# EAGLE schematic circuito_tesi (EAGLE 9.6.2)
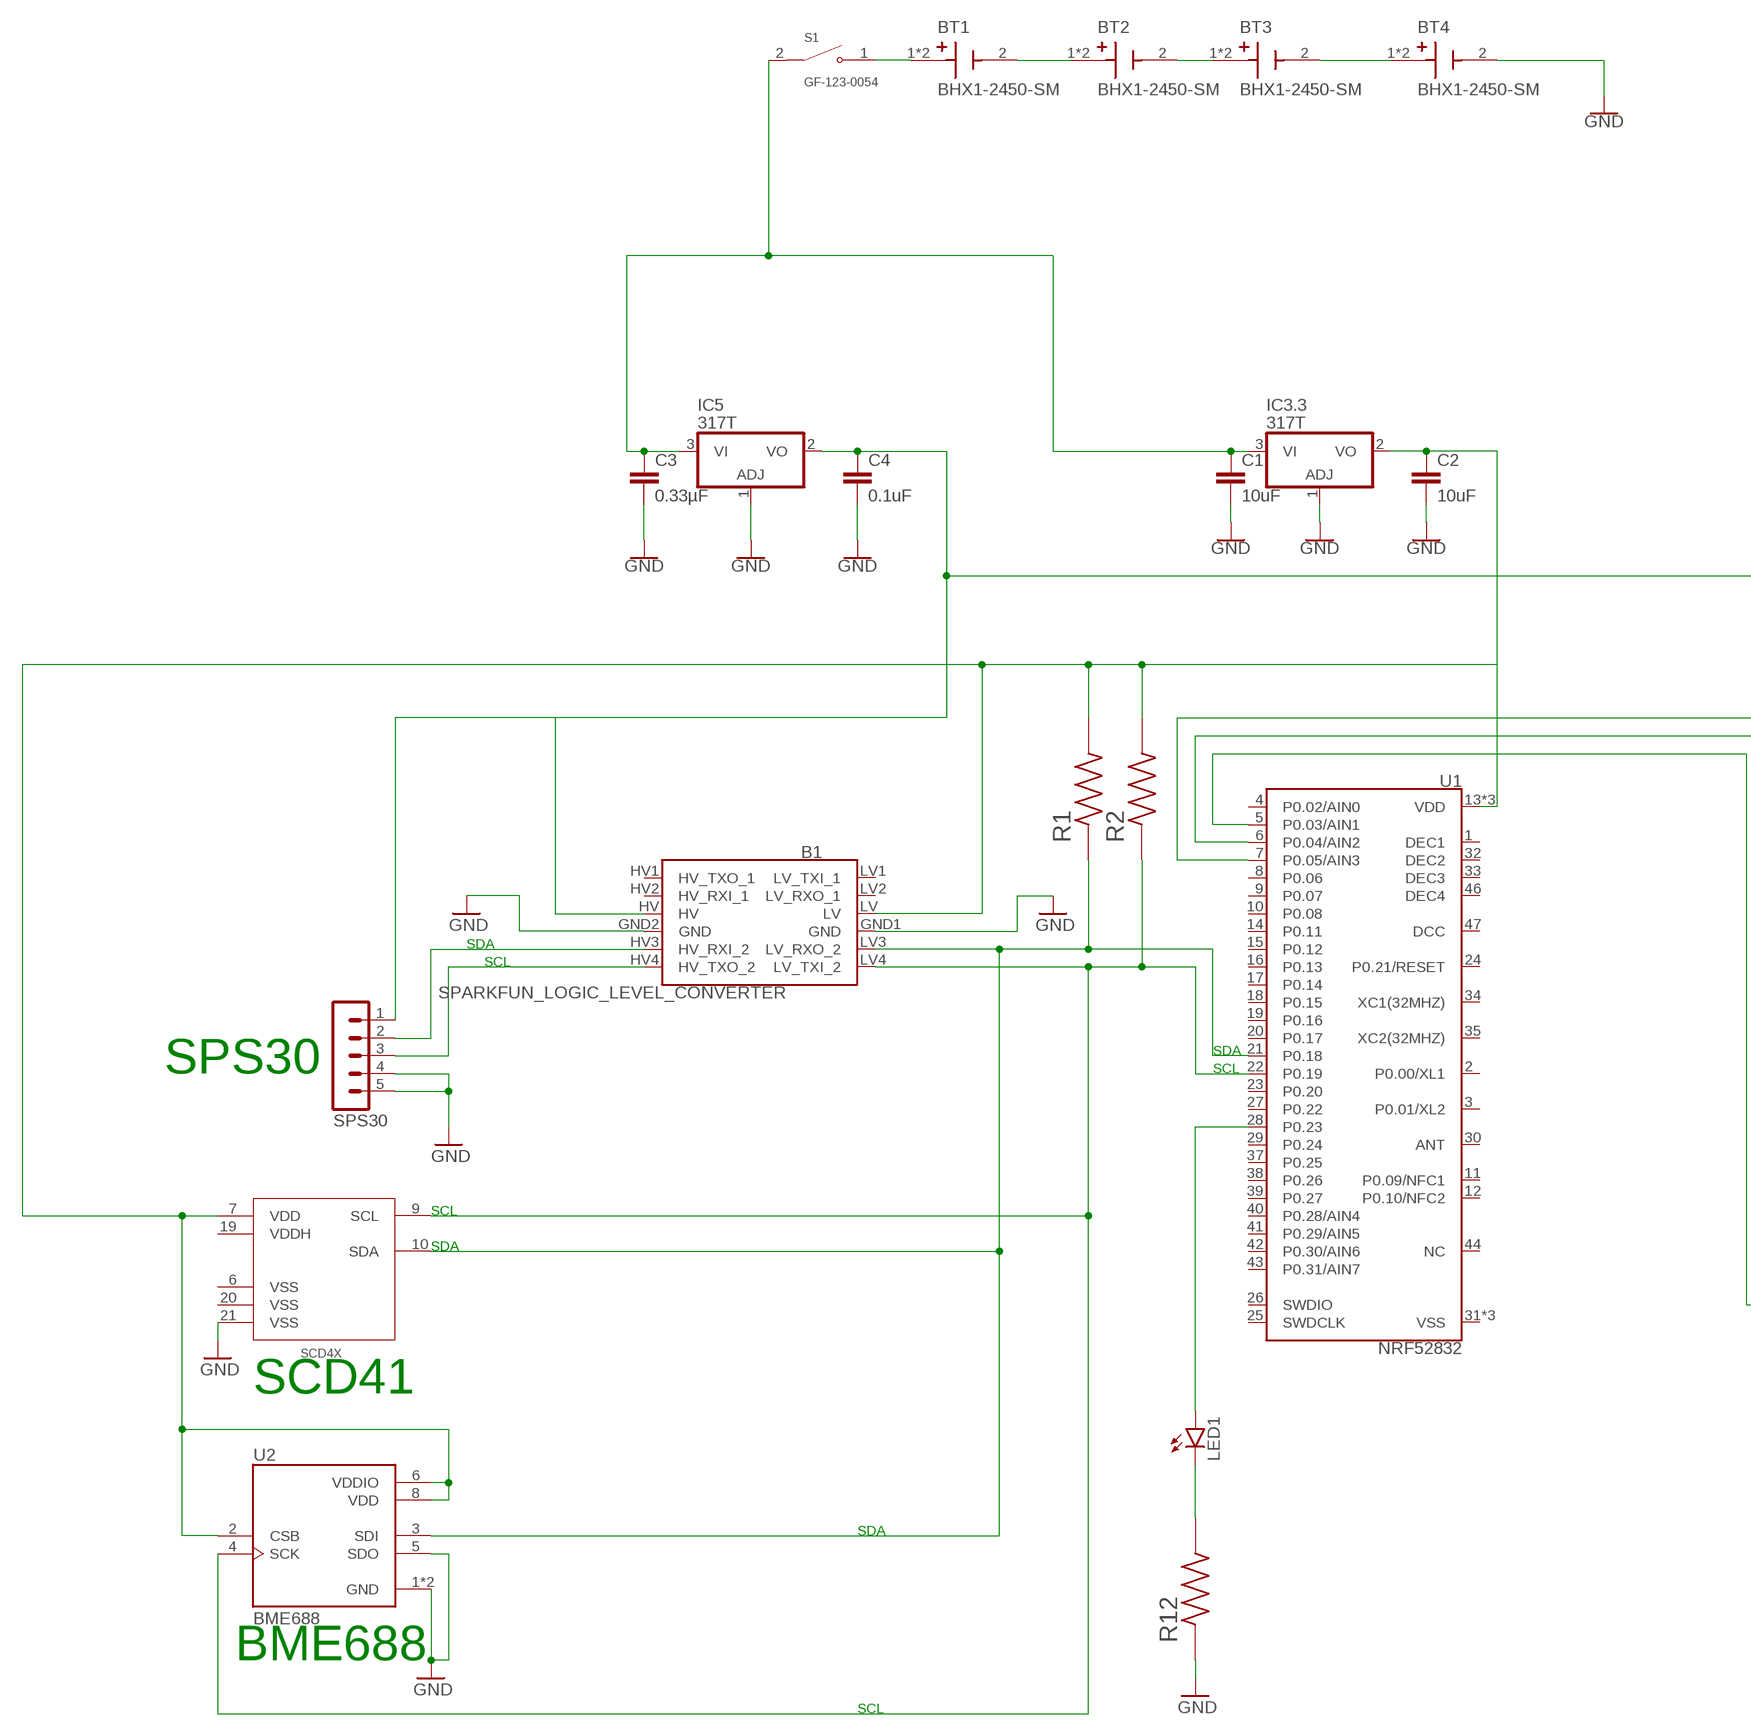
[diagram p0: schematic, sheet 1, part 1 of 2]
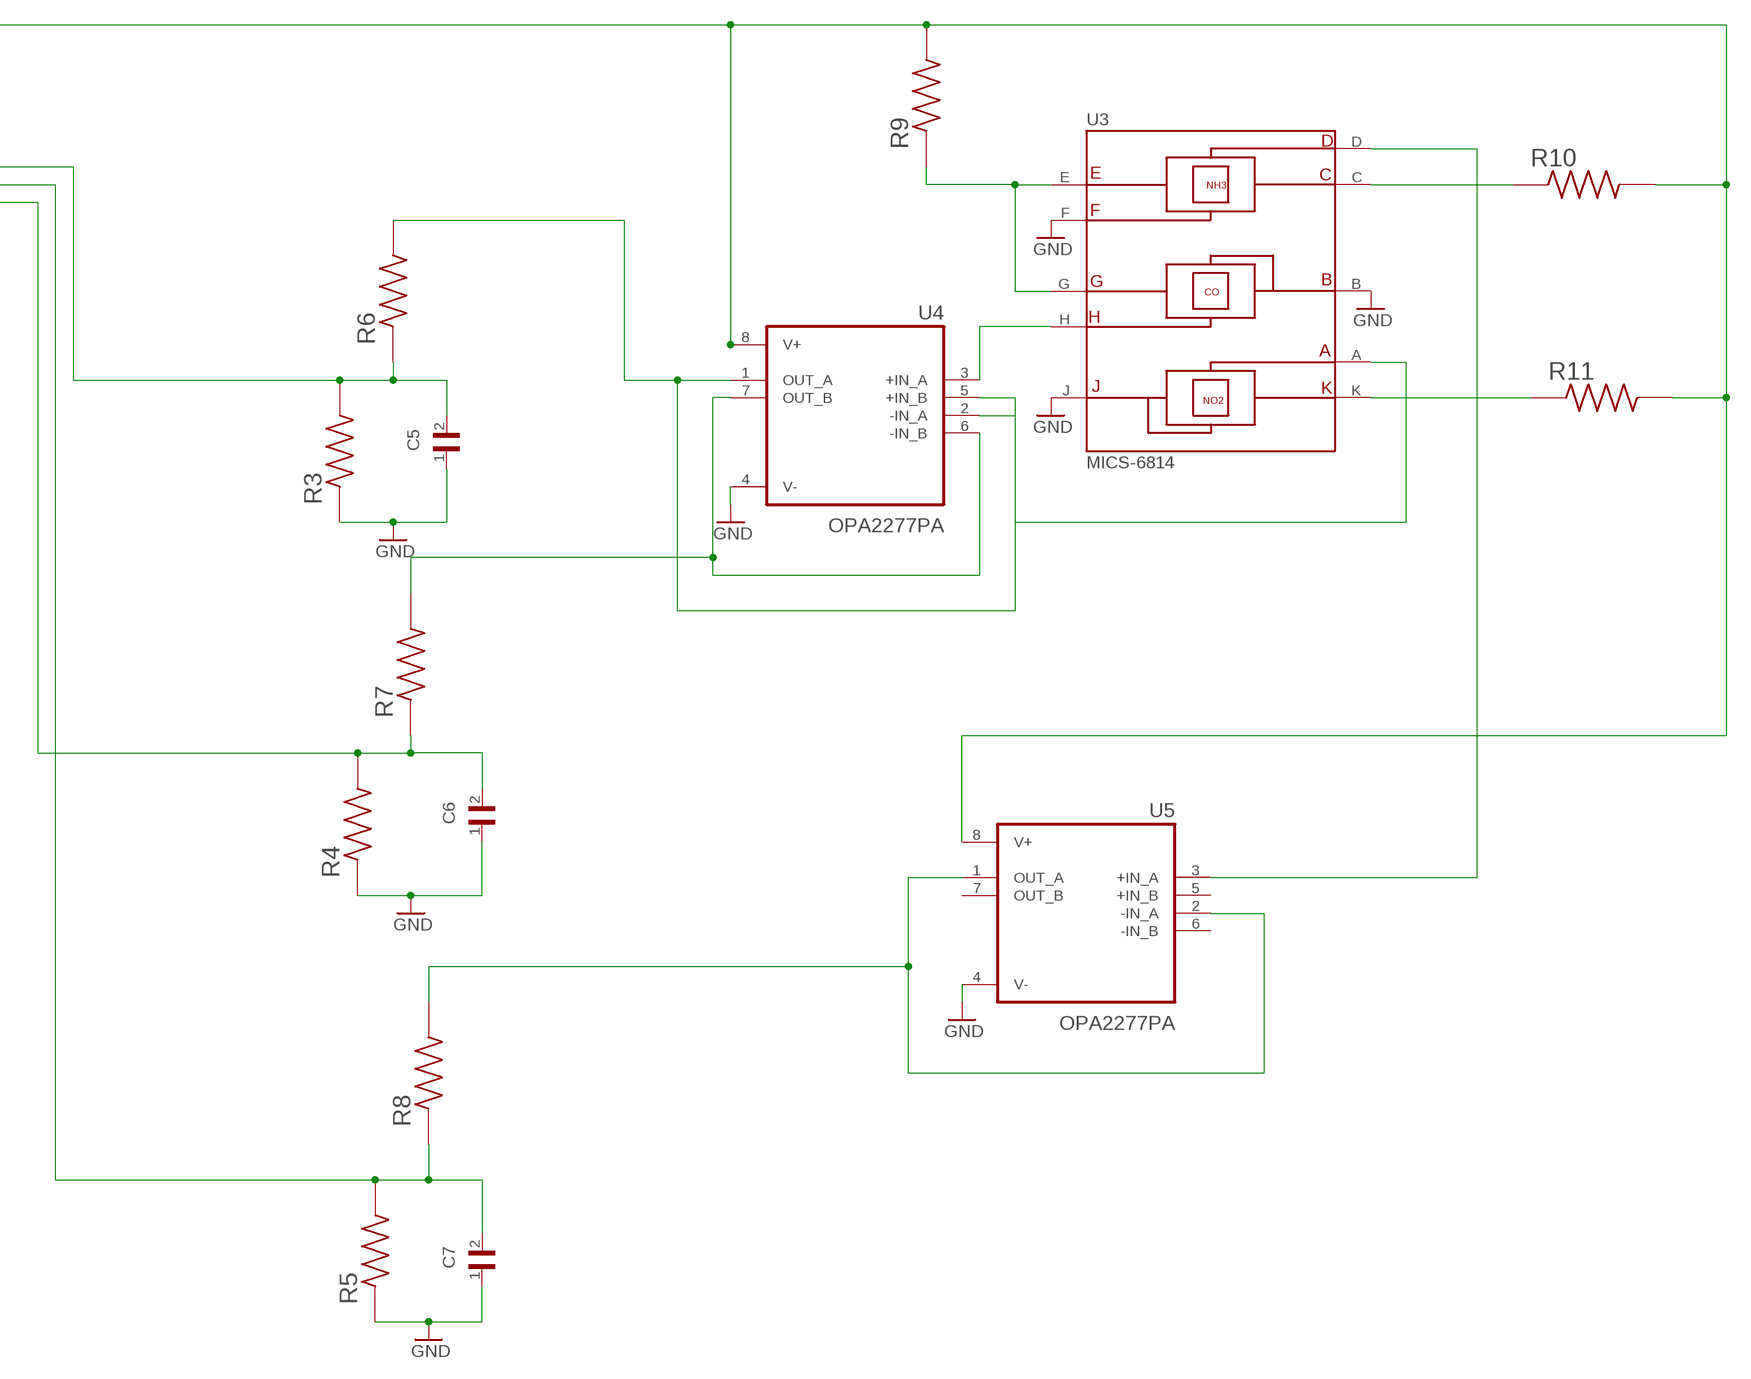
[diagram p1: schematic, sheet 1, part 2 of 2]

## Parts
B1  SPARKFUN_LOGIC_LEVEL_CONVERTER  [SPARKFUN_LOGIC_LEVEL_CONVERTER]
BT1  BHX1-2450-SM  [BAT_BHX1-2450-SM]
BT2  BHX1-2450-SM  [BAT_BHX1-2450-SM]
BT3  BHX1-2450-SM  [BAT_BHX1-2450-SM]
BT4  BHX1-2450-SM  [BAT_BHX1-2450-SM]
C1  10uF  10UF-0805-10V-10%  [0805]
C2  10uF  10UF-0805-10V-10%  [0805]
C3  0.33µF  0.33UF/330NF-0805-50V-10%  [0805]
C4  0.1uF  0.1UF-0603-25V-5%  [0603]
C5  GRM033R60J103KA01D  [CAPC0603X33N]
C6  GRM033R60J103KA01D  [CAPC0603X33N]
C7  GRM033R60J103KA01D  [CAPC0603X33N]
IC3.3  317T  [TO220H]
IC5  317T  [TO220H]
LED1  LAP4-BOTTOM  [P47F-BOTTOM]
R1  RNCF0603BTE10K0  [RESC1508X55N]
R2  RNCF0603BTE10K0  [RESC1508X55N]
R3  RMCF0603FT10M0  [RESC1508X55N]
R4  RMCF0603FT10M0  [RESC1508X55N]
R5  RMCF0603FT10M0  [RESC1508X55N]
R6  RMCF0603FT5M10  [RESC1508X55N]
R7  RMCF0603FT5M10  [RESC1508X55N]
R8  RMCF0603FT5M10  [RESC1508X55N]
R9  RNCF0603DTE820R  [RESC1508X55N]
R10  RMCF0603FT270R  [RESC1508X55N]
R11  RMCF0603FT130R  [RESC1508X55N]
R12  RMCF0603FT300R  [RESC1508X55N]
S1  GF-123-0054  [SW_GF-123-0054]
SCD4X  SCD4XSCD4X_SCD4X_SCD4X  [SCD4X_SCD4X]
SPS30  MA05-1  [MA05-1]
U1  NRF52832  [QFN48-6X6MM]
U2  BME688  [IC_BME688]
U3  MICS-6814  [SENSOR_MICS-6814]
U4  OPA2277PA  [DIP794W45P254L959H508Q8]
U5  OPA2277PA  [DIP794W45P254L959H508Q8]

## Nets
3.3: B1.LV C2.1 IC3.3.2(VO) R1.2 R2.2 SCD4X.7(VDD) U1.13(VDD) U1.36(VDD) U1.48(VDD) U2.2(CSB) U2.6(VDDIO) U2.8(VDD)
5V: B1.HV C4.1 IC5.2(VO) R9.2 R10.2 R11.2 SPS30.1 U4.8(V+) U5.8(V+)
GND: B1.GND1(GND) B1.GND2(GND) BT4.2(-) C1.2 C2.2 C3.2 C4.2 C5.1 C6.1 C7.1 IC3.3.1(ADJ) IC5.1(ADJ) R3.1 R4.1 R5.1 R12.1 SCD4X.21(VSS) SPS30.4 SPS30.5 U2.1(GND) U2.5(SDO) U2.7(GND) U3.B(RH1/RS1_RED) U3.F(RS2_NH3) U3.J(RH1/RS1_OX) U4.4(V-) U5.4(V-)
N$1: B1.HV3(HV_RXI_2) SPS30.2
N$2: BT1.2(-) BT2.1(+) BT2.1_1(+)
N$3: B1.HV4(HV_TXO_2) SPS30.3
N$4: BT2.2(-) BT3.1(+) BT3.1_1(+)
N$5: BT3.2(-) BT4.1(+) BT4.1_1(+)
N$6: U3.A(RS2) U4.5(+IN_B)
N$7: R7.2 U4.6(-IN_B) U4.7(OUT_B)
N$8: R8.2 U5.1(OUT_A) U5.2(-IN_A)
N$9: LED1.C R12.2
N$10: U3.H(RS2_RED) U4.3(+IN_A)
N$11: R9.1 U3.E(RH2_NH3) U3.G(RH2_RED)
N$12: R10.1 U3.C(RH1_NH3)
N$13: R11.1 U3.K(RH2_OX)
N$14: U3.D(RS1_NH3) U5.3(+IN_A)
N$15: C6.2 R4.2 R7.1 U1.5(P0.03/AIN1)
N$16: C7.2 R5.2 R8.1 U1.6(P0.04/AIN2)
N$17: C5.2 R3.2 R6.1 U1.7(P0.05/AIN3)
N$19: BT1.1(+) BT1.1_1(+) S1.1
N$21: LED1.A U1.28(P0.23)
N$22: R6.2 U4.1(OUT_A) U4.2(-IN_A)
SCL: B1.LV4(LV_TXI_2) R2.1 SCD4X.9(SCL) U1.22(P0.19) U2.4(SCK)
SDA: B1.LV3(LV_RXO_2) R1.1 SCD4X.10(SDA) U1.21(P0.18) U2.3(SDI)
VDD: C1.1 C3.1 IC3.3.3(VI) IC5.3(VI) S1.2
Unconnected: B1.HV1(HV_TXO_1) B1.HV2(HV_RXI_1) B1.LV1(LV_TXI_1) B1.LV2(LV_RXO_1) U1.1(DEC1) U1.2(P0.00/XL1) U1.3(P0.01/XL2) U1.4(P0.02/AIN0) U1.8(P0.06) U1.9(P0.07) U1.10(P0.08) U1.11(P0.09/NFC1) U1.12(P0.10/NFC2) U1.14(P0.11) U1.15(P0.12) U1.16(P0.13) U1.17(P0.14) U1.18(P0.15) U1.19(P0.16) U1.20(P0.17) U1.23(P0.20) U1.24(P0.21/RESET) U1.25(SWDCLK) U1.26(SWDIO) U1.27(P0.22) U1.29(P0.24) U1.30(ANT) U1.31(VSS) U1.32(DEC2) U1.33(DEC3) U1.34(XC1(32MHZ)) U1.35(XC2(32MHZ)) U1.37(P0.25) U1.38(P0.26) U1.39(P0.27) U1.40(P0.28/AIN4) U1.41(P0.29/AIN5) U1.42(P0.30/AIN6) U1.43(P0.31/AIN7) U1.44(NC) U1.45(VSS) U1.46(DEC4) U1.47(DCC) U1.EP(VSS) U5.5(+IN_B) U5.6(-IN_B) U5.7(OUT_B)

## Notes on the sheet
- SDA
- SCL
- SDA
- SPS30 | SCL
- SCL
- SDA
- SCD41
- SDA
- BME688
- SCL

## Power pins joined to a net without a drawn wire
VDDH: SCD4X.19(VDDH)
VSS: SCD4X.6(VSS) SCD4X.20(VSS)

## Library data of the parts
B1 = SparkFun-Boards:SPARKFUN_LOGIC_LEVEL_CONVERTER: SparkFun Logic Level Converter -Bi-Directional This is the mechnical outline for the 3.3V - 5V bi directional logic level converter. *Note, the "LOCK" Package has the header pins staggered by an offset of 5 mils (off center line), so that when you slide a row of standard 0.1" headers into the PTH pads, it will hold position vertically. See the follwing turorial for more information on this type of special footprints: Sneaky Footprints <https://www.sparkfun.com/tutorials/114> SparkFun Products: SparkFun Logic Level Converter - Bi-Directional <https://www.sparkfun.com/products/12009>
BT1-BT4 = BHX1-2450-SM:BHX1-2450-SM: CR2450 surface mount battery retainer with insulator; MF: MPD (Memory Protection Devices); MP: BHX1-2450-SM; PACKAGE: None; PURCHASE-URL: https://pricing.snapeda.com/search/part/BHX1-2450-SM/?ref=eda
C1 C2 = SparkFun-Capacitors:10UF: 10.0µF ceramic capacitors A capacitor is a passive two-terminal electrical component used to store electrical energy temporarily in an electric field.; PROD_ID: CAP-11330
C3 = SparkFun-Capacitors:0.33UF/330NF: 0.33µF/330nF ceramic capacitors A capacitor is a passive two-terminal electrical component used to store electrical energy temporarily in an electric field.; PROD_ID: CAP-08469
C4 = SparkFun-Capacitors:0.1UF: 0.1µF ceramic capacitors A capacitor is a passive two-terminal electrical component used to store electrical energy temporarily in an electric field.; PROD_ID: CAP-08604
C5-C7 = Condens_10nF:GRM033R60J103KA01D: SMD Capacitor X5R(EIA) with Capacitance: 10000pF Tol. 10%. Rated Voltage: 6.3Vdc; DESCRIPTION: SMD capacitor X5R(EIA) with capacitance 10000pF Tol.10%. Rated voltage 6.3Vdc 85C; DIGI-KEY_PART_NUMBER: 490-5403-2-ND; MF: Murata; MP: GRM033R60J103KA01D; PACKAGE: 0603 Taiyo Yuden; PURCHASE-URL: https://pricing.snapeda.com/search/part/GRM033R60J103KA01D/?ref=eda
IC3.3 IC5 = linear:*317: Positive VOLTAGE REGULATOR
LED1 = led:*P4: PointLED® Enhanced Thinfilm LED TOP & BOTTOM mount LS P47F, LR P47F, LA P47F, LY P47F, LT P4SG, LB P4SG, LW P4SG Source: http://catalog.osram-os.com .. LA_LR_LS_LY_P47F_Pb_free.pdf
R1 R2 = Res_10KOHM:RNCF0603BTE10K0; DESCRIPTION: 10 kOhms ±0.1% 0.1W, 1/10W Chip Resistor 0603 (1608 Metric) Automotive AEC-Q200 Thin Film; DIGI-KEY_PART_NUMBER: RNCF0603BTE10K0TR-ND; MF: Stackpole Electronics Inc; MP: RNCF0603BTE10K0; PACKAGE: 1508 Stackpole; PURCHASE-URL: https://pricing.snapeda.com/search/part/RNCF0603BTE10K0/?ref=eda
R3-R5 = Res_10MOHM_2:RMCF0603FT10M0; DESCRIPTION: 10 MOhms ±1% 0.1W, 1/10W Chip Resistor 0603 (1608 Metric) Automotive AEC-Q200 Thick Film; DIGI-KEY_PART_NUMBER: RMCF0603FT10M0TR-ND; MF: Stackpole Electronics Inc; MP: RMCF0603FT10M0; PACKAGE: 1508 Stackpole; PURCHASE-URL: https://pricing.snapeda.com/search/part/RMCF0603FT10M0/?ref=eda
R6-R8 = Res_5.1MOHM:RMCF0603FT5M10; DESCRIPTION: 5.1 MOhms ±1% 0.1W, 1/10W Chip Resistor 0603 (1608 Metric) Automotive AEC-Q200 Thick Film; DIGI-KEY_PART_NUMBER: RMCF0603FT5M10TR-ND; MF: Stackpole Electronics Inc; MP: RMCF0603FT5M10; PACKAGE: 1508 Stackpole; PURCHASE-URL: https://pricing.snapeda.com/search/part/RMCF0603FT5M10/?ref=eda
R9 = Res_820OHM:RNCF0603DTE820R; DESCRIPTION: 820 ±0.5% 0.1W, 1/10W Chip Resistor 0603 (1608 Metric) Automotive AEC-Q200 Thin Film; DIGI-KEY_PART_NUMBER: RNCF0603DTE820RTR-ND; MF: Stackpole Electronics Inc; MP: RNCF0603DTE820R; PACKAGE: 1508 Stackpole; PURCHASE-URL: https://pricing.snapeda.com/search/part/RNCF0603DTE820R/?ref=eda
R10 = Res_270OHM:RMCF0603FT270R; DESCRIPTION: 270 Ohms ±1% 0.1W, 1/10W Chip Resistor 0603 (1608 Metric) Automotive AEC-Q200 Thick Film; DIGI-KEY_PART_NUMBER: RMCF0603FT270RTR-ND; MF: Stackpole Electronics Inc; MP: RMCF0603FT270R; PACKAGE: 1508 Stackpole; PURCHASE-URL: https://pricing.snapeda.com/search/part/RMCF0603FT270R/?ref=eda
R11 = Res_130OHM:RMCF0603FT130R; DESCRIPTION: 130 Ohms ±1% 0.1W, 1/10W Chip Resistor 0603 (1608 Metric) Automotive AEC-Q200 Thick Film; DIGI-KEY_PART_NUMBER: RMCF0603FT130RTR-ND; MF: Stackpole Electronics Inc; MP: RMCF0603FT130R; PACKAGE: 1508 Stackpole; PURCHASE-URL: https://pricing.snapeda.com/search/part/RMCF0603FT130R/?ref=eda
R12 = Res_300OHM:RMCF0603FT300R; DESCRIPTION: 300 Ohms ±1% 0.1W, 1/10W Chip Resistor 0603 (1608 Metric) Automotive AEC-Q200 Thick Film; DIGI-KEY_PART_NUMBER: RMCF0603FT300RTR-ND; MF: Stackpole Electronics Inc; MP: RMCF0603FT300R; PACKAGE: 1508 Stackpole; PURCHASE-URL: https://pricing.snapeda.com/search/part/RMCF0603FT300R/?ref=eda
S1 = GF-123-0054:GF-123-0054: Slide Switch SPST Through Hole; DESCRIPTION: Slide Switch SPST Through Hole; DIGI-KEY_PART_NUMBER: CWI333-ND; MF: CW Industries; MP: GF-123-0054; PACKAGE: None; PURCHASE-URL: https://pricing.snapeda.com/search/part/GF-123-0054/?ref=eda
SCD4X = SCD41-D-R1:SCD4X: No description set
SPS30 = con-lstb:MA05-1: PIN HEADER; OC_FARNELL: unknown; OC_NEWARK: unknown
U1 = SparkFun-RF:NRF52832: Nordic nRF52832 Bluetooth Smart/ANT/2.4GHz RF SoC The nRF52832 SoC is a powerful, highly flexible ultra-low power multiprotocol SoC ideally suited for Bluetooth® Smart ANT and 2.4GHz ultra low-power wireless applications. The nRF52832 SoC is built around a 32-bit ARM® Cortex™-M4F CPU with 512kB + 64kB RAM. The embedded 2.4GHz transceiver supports Bluetooth Smart, ANT and proprietary 2.4 GHz protocol stack. It is on air compatible with the nRF51 Series, nRF24L and nRF24AP Series products from Nordic Semiconductor. Datasheet <https://cdn.sparkfun.com/datasheets/Wireless/Bluetooth/nRF52832_PS_v1.0.pdf> SparkFun Products: SparkFun nRF52832 Breakout <https://www.sparkfun.com/products/13990>; PROD_ID: IC-13460
U2 = BME688:BME688: Gas sensor measuring relative humidity, barometric pressure, ambient temperature and gas (VOC) Check availability <https://pricing.snapeda.com/parts/BME688/Bosch%20Sensortec/view-part?ref=eda>; AVAILABILITY: In Stock; DESCRIPTION: Gas sensor measuring relative humidity, barometric pressure, ambient temperature and gas (VOC); MF: Bosch Sensortec; MP: BME688; PACKAGE: None; PRICE: None; PURCHASE-URL: https://pricing.snapeda.com/search/part/BME688/?ref=eda
U3 = MICS-6814:MICS-6814: Three gas SMD NH3, CO and NO2 Check availability <https://pricing.snapeda.com/parts/MICS-6814/MikroElektronika/view-part?ref=eda>; AVAILABILITY: Not in stock; DESCRIPTION: MiCS-6814 Air Quality Sensor mikroBUS™ Click™ Platform Evaluation Expansion Board; MF: MikroElektronika; MP: MICS-6814; PACKAGE: None; PRICE: None
U4 U5 = OPA2277PA:OPA2277PA; DESCRIPTION: 10µV, 0.1µV/˚C, High-Precision, Low-Power Operational Amplifier; DIGI-KEY_PART_NUMBER: OPA2277PA-ND; MF: Texas Instruments; MP: OPA2277PA; PACKAGE: PDIP-8 Texas; PURCHASE-URL: https://pricing.snapeda.com/search/part/OPA2277PA/?ref=eda